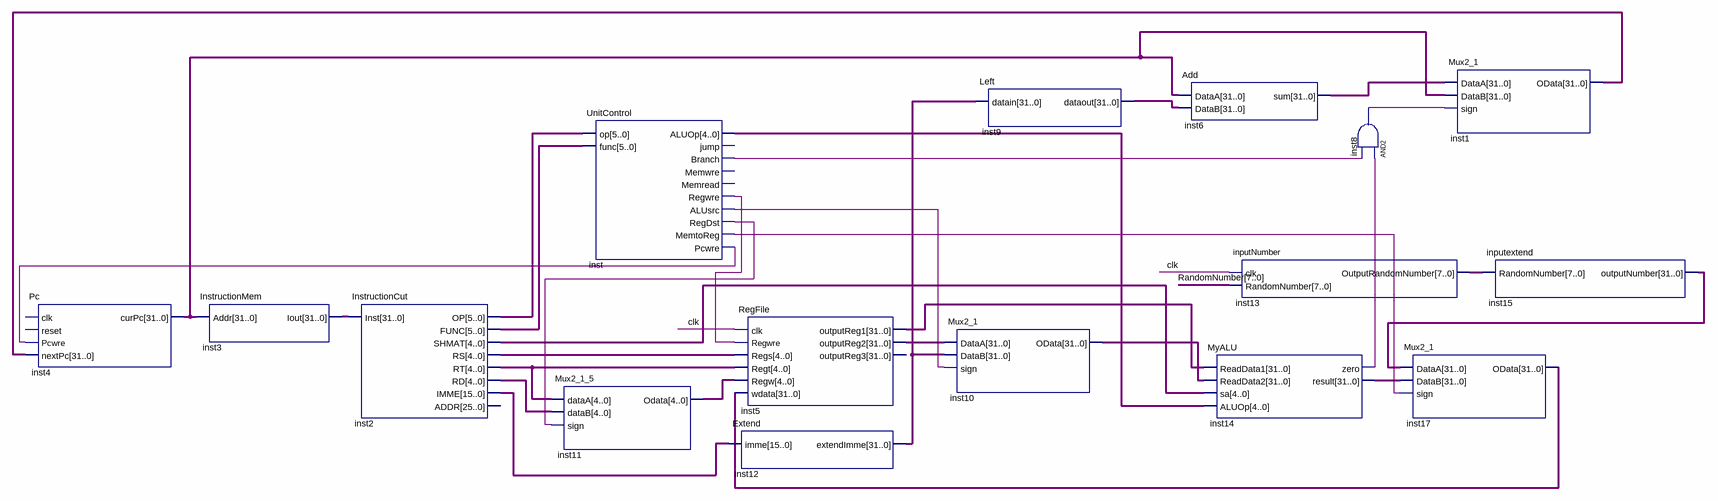
[diagram p0: schematic sheet]
// Quartus schematic Cpu_iput.bdf as structural Verilog: 16 symbols, 0 pins
module Cpu_iput (
);

  wire clk, inst8_out, inst14_zero, inst_alusrc, inst_branch, inst_memtoreg, inst_pcwre, inst_regdst,
       inst_regwre;
  wire [4:0] inst2_rd, inst2_rs, inst2_rt, inst2_shmat, inst11_odata, inst_aluop;
  wire [5:0] inst2_func, inst2_op;
  wire [7:0] inst13_outputrandomnumber, RandomNumber;
  wire [15:0] inst2_imme;
  wire [31:0] inst1_odata, inst3_iout, inst4_curpc, inst5_outputreg1, inst5_outputreg2, inst6_sum,
       inst9_dataout, inst10_odata, inst12_extendimme, inst14_result, inst15_outputnumber, inst17_odata;

  Pc inst4 (.Pcwre(inst_pcwre), .nextPc(inst1_odata), .curPc(inst4_curpc));  // open: clk, reset
  InstructionMem inst3 (.Addr(inst4_curpc), .Iout(inst3_iout));
  InstructionCut inst2 (
    .Inst(inst3_iout), .OP(inst2_op), .FUNC(inst2_func), .SHMAT(inst2_shmat), .RS(inst2_rs), .RT(inst2_rt),
    .RD(inst2_rd), .IMME(inst2_imme));  // open: ADDR
  UnitControl inst (
    .op(inst2_op), .func(inst2_func), .ALUOp(inst_aluop), .Branch(inst_branch), .Regwre(inst_regwre),
    .ALUsrc(inst_alusrc), .RegDst(inst_regdst), .MemtoReg(inst_memtoreg), .Pcwre(inst_pcwre));  // open: jump, Memwre, Memread
  Mux2_1_5 inst11 (.dataA(inst2_rt), .dataB(inst2_rd), .sign(inst_regdst), .Odata(inst11_odata));
  RegFile inst5 (
    .clk(clk), .Regwre(inst_regwre), .Regs(inst2_rs), .Regt(inst2_rt), .Regw(inst11_odata),
    .wdata(inst17_odata), .outputReg1(inst5_outputreg1), .outputReg2(inst5_outputreg2));  // open: outputReg3
  Extend inst12 (.imme(inst2_imme), .extendImme(inst12_extendimme));
  Mux2_1 inst10 (.DataA(inst5_outputreg2), .DataB(inst12_extendimme), .sign(inst_alusrc), .OData(inst10_odata));
  Left inst9 (.datain(inst12_extendimme), .dataout(inst9_dataout));
  Add inst6 (.DataA(inst4_curpc), .DataB(inst9_dataout), .sum(inst6_sum));
  MyALU inst14 (
    .ReadData1(inst5_outputreg1), .ReadData2(inst10_odata), .sa(inst2_shmat), .ALUOp(inst_aluop),
    .zero(inst14_zero), .result(inst14_result));
  inputNumber inst13 (.clk(clk), .RandomNumber(RandomNumber), .OutputRandomNumber(inst13_outputrandomnumber));
  and inst8 (inst8_out, inst14_zero, inst_branch);
  Mux2_1 inst17 (.DataA(inst15_outputnumber), .DataB(inst14_result), .sign(inst_memtoreg), .OData(inst17_odata));
  Mux2_1 inst1 (.DataA(inst6_sum), .DataB(inst4_curpc), .sign(inst8_out), .OData(inst1_odata));
  inputextend inst15 (.RandomNumber(inst13_outputrandomnumber), .outputNumber(inst15_outputnumber));
endmodule
